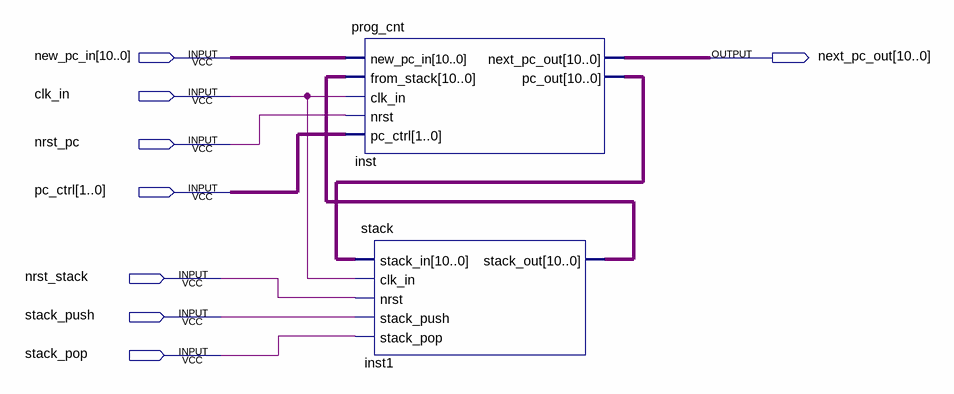
[diagram p0: schematic sheet]
// Quartus schematic stack_prog_cnt.bdf as structural Verilog: 2 symbols, 8 pins
module stack_prog_cnt (
  input  [10:0] new_pc_in,
  input  clk_in,
  input  nrst_pc,
  input  [1:0] pc_ctrl,
  input  nrst_stack,
  input  stack_push,
  input  stack_pop,
  output [10:0] next_pc_out
);

  wire [10:0] inst1_stack_out, inst_pc_out;

  prog_cnt inst (
    .new_pc_in(new_pc_in), .from_stack(inst1_stack_out), .clk_in(clk_in), .nrst(nrst_pc), .pc_ctrl(pc_ctrl),
    .next_pc_out(next_pc_out), .pc_out(inst_pc_out));
  stack inst1 (
    .stack_in(inst_pc_out), .clk_in(clk_in), .nrst(nrst_stack), .stack_push(stack_push),
    .stack_pop(stack_pop), .stack_out(inst1_stack_out));
endmodule
